# EAGLE design 1020 (EAGLE 9.5.2)
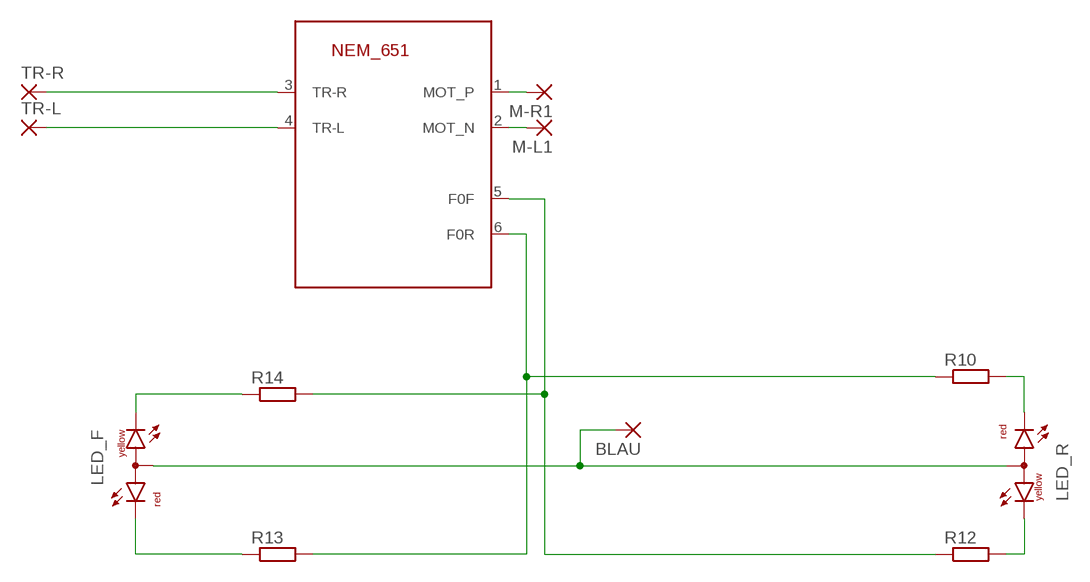
[diagram p0: schematic, sheet 1]

## Parts
651  NEM_651-TS  [53047-06]
BLAU  1,6/0,8  [1,6/0,8]
LED_F  DUOLED-RY-A  [DUOLED-A-5MM]
LED_R  DUOLED-RY-A  [DUOLED-A-5MM]
M-L1  SMD5  [SMD2,54-5,08]
M-R1  SMD5  [SMD2,54-5,08]
R10  R-EU_R1206  [R1206]
R12  R-EU_R1206  [R1206]
R13  R-EU_R1206  [R1206]
R14  R-EU_R1206  [R1206]
TR-L  SMD5  [SMD2,54-5,08]
TR-R  SMD5  [SMD2,54-5,08]

## Nets
N$2: BLAU.1(P) LED_F.A LED_R.A
N$4: 651.4(TR-L) TR-L.1(P)
N$11: 651.3(TR-R) TR-R.1(P)
N$13: 651.5(F0F) R12.1 R14.2
N$15: LED_R.CR R10.2
N$16: LED_R.CX(CY) R12.2
N$17: 651.6(F0R) R10.1 R13.2
N$18: LED_F.CR R13.1
N$19: LED_F.CX(CY) R14.1
N$20: 651.1(MOT_P) M-R1.1(P)
N$21: 651.2(MOT_N) M-L1.1(P)

## Library data of the parts
651 = con-nem:NEM_651: NEM651 Decoder Plug
BLAU = wirepad:1,6/0,8: THROUGH-HOLE PAD
LED_F LED_R = led:DUOLED-RY-A: DUO LED 2 colors (red/yellow), 5 mm, round, common Anode www.ligitek.com or other producers.
M-L1 M-R1 TR-L TR-R = wirepad:SMD5: SMD PAD
R10 R12-R14 = rcl:R-EU_: RESISTOR, European symbol; SPICEPREFIX: R

## Board
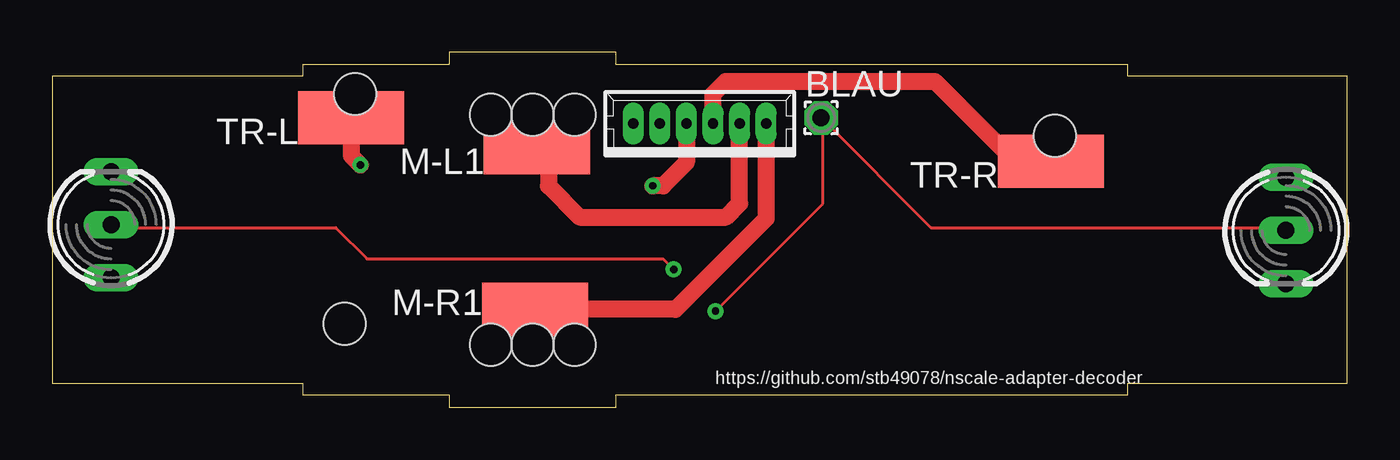
[diagram p1: board, top side]
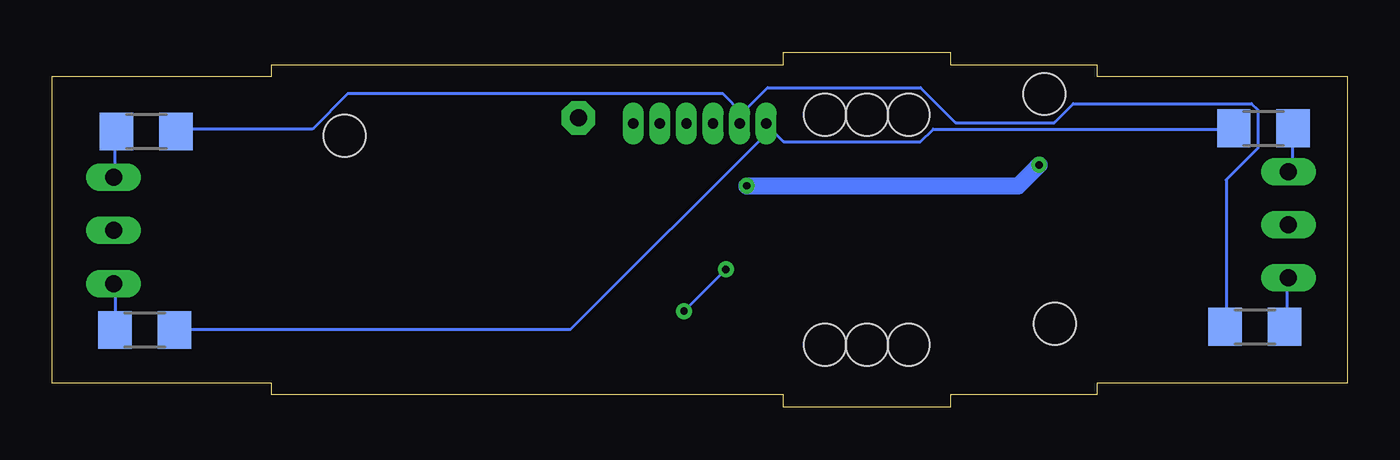
[diagram p2: board, bottom side, seen from below]

Size 62 x 17 mm. Coordinates in mm from the lower left corner, seen from the top.
Outline: 0,1.15 12,1.15 12,0.6 19,0.6 19,0 27,0 27,0.6 51.5,0.6 51.5,1.15 62,1.15 62,15.85 51.5,15.85 51.5,16.4 27,16.4 27,17 19,17 19,16.4 12,16.4 12,15.85 0,15.85 0,1.15
Copper layers (1*16): Top 0.035mm / dielectric 1.5mm / Bottom 0.035mm
Design rules "default *": minimum track width 6mil, minimum drill 0.35mm, track to track 6mil, track to pad 6mil, pad to pad 6mil, via to via 6mil, smd to smd 6mil, copper to edge 6mil, drill to drill 6mil, minimum pad ring 10mil, minimum via ring 8mil, stop-mask expansion 4mil, vias tented up to drill 0mil, thermal gap 10mil
Holes 2 mm at 14,4 14.5,15 48,13 21,3 23,3 25,3 21,14 23,14 25,14

### Footprints (pad centres in the part's own frame; a part is rotated, then mirrored left to right if it is on the bottom)
53047-06 = drill 0.5 pad 0.698 long: 1 3.175,0; 2 1.905,0; 3 0.635,0; 4 -0.635,0; 5 -1.905,0; 6 -3.175,0
1,6/0,8 = drill 0.813 pad 1.6 octagon: 1 0,0
DUOLED-A-5MM = drill 0.813 long: A 0,0; CR 2.54,0; CX -2.54,0
SMD2,54-5,08 = smd 2.54 x 5.08: 1 0,0
R1206 = smd 1.6 x 1.803: 1 -1.422,0; 2 1.422,0

### Placement (x,y rotation side)
651  31,13.58 0 top
BLAU  36.81,13.86 0 top
LED_F  2.82,8.75 90 top
LED_R  59.06,8.47 270 top
M-L1  23.2,12.44 90 top
M-R1  23.11,4.69 90 top
R10  57.58,3.71 180 bottom
R12  57.5,13.21 180 bottom
R13  4.01,13.36 180 bottom
R14  4.43,3.86 180 bottom
TR-L  14.31,13.87 90 top
TR-R  47.81,11.79 90 top

### Tracks (layer width: path | path; a pad name or v marks a point on that pad's centre or on a via)
N$2  (via drill 0.35)
  Top 0.152: 36.89,13.78 42.07,8.6 58.99,8.6 LED_R.A | 36.89,13.78 BLAU.1 | LED_F.A 2.91,8.6 13.58,8.6 15.07,7.11 29.25,7.11 v29.75,6.61 | v31.75,4.61 36.89,9.75 36.89,13.78
  Bottom 0.152: v29.75,6.61 v31.75,4.61
N$4  (via drill 0.35)
  Top 0.152: TR-L.1 14.19,13.78 14.31,13.44
  Top 0.813: 651.4 30.36,11.72 29.25,10.61 v28.75,10.61 | v14.75,11.61 14.31,12.05 14.31,13.44 14.25,13.44
  Bottom 0.813: v14.75,11.61 15.75,10.61 v28.75,10.61
N$11
  Top 0.152: TR-R.1 47.87,11.65 47.81,11.44
  Top 0.813: 651.3 31.63,14.99 32.25,15.61 42.25,15.61 46.42,11.44 47.81,11.44
N$13
  Bottom 0.152: 28.97,14.09 27.75,15.31 20.43,15.31 18.76,13.63 14.03,13.63 13.12,14.54 4.58,14.54 4.28,14.24 4.28,12.41 5.8,10.89 5.8,3.88 R14.2 | 28.97,14.09 28.97,13.63 651.5 28.97,14.09 | 28.97,14.09 29.88,15 47.87,15 49.54,13.33 55.94,13.33 R12.1
N$15
  Bottom 0.152: R10.2 58.99,3.73 58.99,5.86 LED_R.CR
N$16
  Bottom 0.152: R12.2 58.99,13.17 58.99,11.04 LED_R.CX
N$17
  Bottom 0.152: 27.6,13.33 27.75,13.48 651.6 27.6,13.33 | 27.6,13.33 26.99,12.72 20.43,12.72 19.82,13.33 5.5,13.33 R13.2 | 27.6,13.33 37.2,3.73 56.09,3.73 R10.1
N$18
  Bottom 0.152: R13.1 2.6,13.33 2.6,11.5 2.75,11.34 LED_F.CR
N$19
  Bottom 0.152: R14.1 2.91,3.88 2.91,6.16 LED_F.CX
N$20
  Top 0.813: 651.1 34.17,9.04 29.83,4.69 M-R1.1
N$21
  Top 0.813: M-L1.1 23.75,11.89 23.75,10.61 25.25,9.11 32.25,9.11 32.91,9.76 651.2

### Text on the board
tNames: https://github.com/stb49078/nscale-adapter-decoder